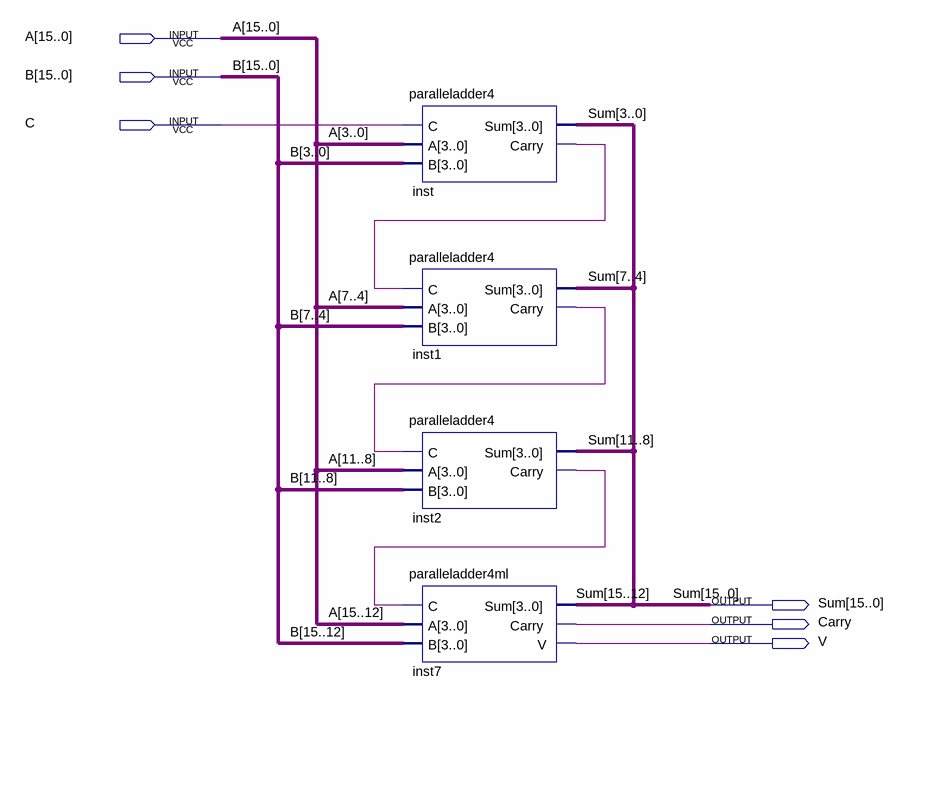
[diagram p0: schematic sheet]
// Quartus schematic paralleladder16.bdf as structural Verilog: 4 symbols, 6 pins
module paralleladder16 (
  input  [15:0] A,
  input  [15:0] B,
  input  C,
  output [15:0] Sum,
  output Carry,
  output V
);

  wire inst1_carry, inst2_carry, inst_carry;

  paralleladder4 inst (.C(C), .A(A[3:0]), .B(B[3:0]), .Sum(Sum[3:0]), .Carry(inst_carry));
  paralleladder4 inst1 (.C(inst_carry), .A(A[7:4]), .B(B[7:4]), .Sum(Sum[7:4]), .Carry(inst1_carry));
  paralleladder4 inst2 (.C(inst1_carry), .A(A[11:8]), .B(B[11:8]), .Sum(Sum[11:8]), .Carry(inst2_carry));
  paralleladder4ml inst7 (.C(inst2_carry), .A(A[15:12]), .B(B[15:12]), .Sum(Sum[15:12]), .Carry(Carry), .V(V));
endmodule
